# EAGLE design ultra (EAGLE 9.6.2)
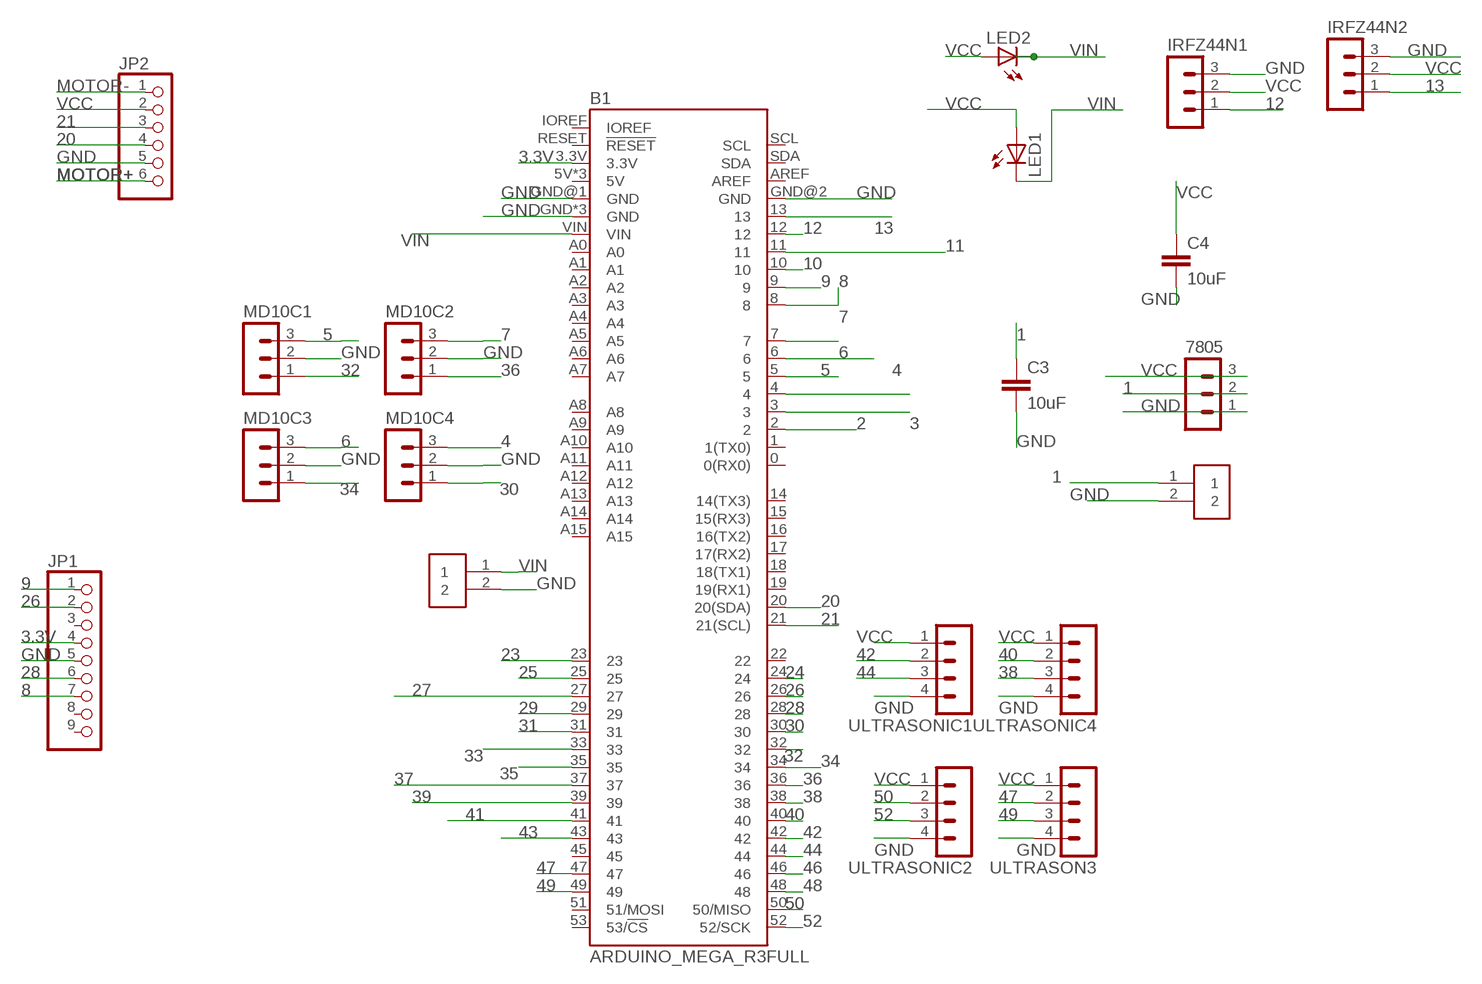
[diagram p0: schematic, sheet 1]

## Parts
7805  MA03-1  [MA03-1]
B1  ARDUINO_MEGA_R3FULL  [ARDUINO_MEGA_NO_SILK]
C3  10uF  10UF-0402T-6.3V-20%  [0402-TIGHT]
C4  10uF  10UF-0402T-6.3V-20%  [0402-TIGHT]
IRFZ44N1  MA03-1  [MA03-1]
IRFZ44N2  MA03-1  [MA03-1]
J1  691311400102  [TERMINALBLOCK_PLUGGABLE-2-7.62MM]
J2  691311400102  [TERMINALBLOCK_PLUGGABLE-2-7.62MM]
JP1  PINHD-1X9  [1X09-BIG]
JP2  PINHD-1X6  [1X06]
LED1  LED  [SMARTLED-TTW]
LED2  LED  [SMARTLED-TTW]
MD10C1  MA03-1  [MA03-1]
MD10C2  MA03-1  [MA03-1]
MD10C3  MA03-1  [MA03-1]
MD10C4  MA03-1  [MA03-1]
ULTRASON3  MA04-1  [MA04-1]
ULTRASONIC1  MA04-1  [MA04-1]
ULTRASONIC2  MA04-1  [MA04-1]
ULTRASONIC4  MA04-1  [MA04-1]

## Nets
1: 7805.2 C3.1 J2.1
2: B1.2
3: B1.3
3.3V: B1.3.3V JP1.4
4: B1.4 MD10C4.3
5: B1.5 MD10C1.3
6: B1.6 MD10C3.3
7: B1.7 MD10C2.3
8: B1.8 JP1.7
9: B1.9 JP1.1
10: B1.10
11: B1.11
12: B1.12 IRFZ44N1.1
13: B1.13 IRFZ44N2.1
20: B1.20(20(SDA)) JP2.4
21: B1.21(21(SCL)) JP2.3
23: B1.23
24: B1.24
25: B1.25
26: B1.26 JP1.2
27: B1.27
28: B1.28 JP1.6
29: B1.29
30: B1.30 MD10C4.1
31: B1.31
32: B1.32 MD10C1.1
33: B1.33
34: B1.34 MD10C3.1
35: B1.35
36: B1.36 MD10C2.1
37: B1.37
38: B1.38 ULTRASONIC4.3
39: B1.39
40: B1.40 ULTRASONIC4.2
41: B1.41
42: B1.42 ULTRASONIC1.2
43: B1.43
44: B1.44 ULTRASONIC1.3
46: B1.46
47: B1.47 ULTRASON3.2
48: B1.48
49: B1.49 ULTRASON3.3
50: B1.50(50/MISO) ULTRASONIC2.2
52: B1.52(52/SCK) ULTRASONIC2.3
GND: 7805.1 B1.GND B1.GND@1(GND) B1.GND@2(GND) B1.GND@3(GND) B1.GND@4(GND) C3.2 C4.2 IRFZ44N1.3 IRFZ44N2.3 J1.2 J2.2 JP1.5 JP2.5 MD10C1.2 MD10C2.2 MD10C3.2 MD10C4.2 ULTRASON3.4 ULTRASONIC1.4 ULTRASONIC2.4 ULTRASONIC4.4
MOTOR+: JP2.6
MOTOR-: JP2.1
VCC: 7805.3 C4.1 IRFZ44N1.2 IRFZ44N2.2 JP2.2 LED1.A@1(A) LED2.A@1(A) ULTRASON3.1 ULTRASONIC1.1 ULTRASONIC2.1 ULTRASONIC4.1
VIN: B1.VIN J1.1 LED1.C@1(C) LED2.C@1(C)
Unconnected: B1.0(0(RX0)) B1.1(1(TX0)) B1.5V B1.5V@1(5V) B1.5V@2(5V) B1.14(14(TX3)) B1.15(15(RX3)) B1.16(16(TX2)) B1.17(17(RX2)) B1.18(18(TX1)) B1.19(19(RX1)) B1.22 B1.45 B1.51(51/MOSI) B1.53(53/!CS) B1.A0 B1.A1 B1.A2 B1.A3 B1.A4 B1.A5 B1.A6 B1.A7 B1.A8 B1.A9 B1.A10 B1.A11 B1.A12 B1.A13 B1.A14 B1.A15 B1.AREF B1.IOREF B1.RESET(!RESET) B1.SCL B1.SDA JP1.3 JP1.8 JP1.9

## Library data of the parts
7805 IRFZ44N1 IRFZ44N2 MD10C1-MD10C4 = con-lstb:MA03-1: PIN HEADER; OC_FARNELL: unknown; OC_NEWARK: unknown
B1 = SparkFun-Boards:ARDUINO_MEGA_R3: Arduino Mega R3 ATmega2560 R3 compatible footprint. SparkFun Products: Arduino Mega 2560 R3 <https://www.sparkfun.com/products/11061>
C3 C4 = SparkFun-Capacitors:10UF: 10.0µF ceramic capacitors A capacitor is a passive two-terminal electrical component used to store electrical energy temporarily in an electric field.; PROD_ID: CAP-14848
J1 J2 = Terminal Blocks FOR USE IN PB:691311400102: 7.62MM CLOSE VERTICAL PCB HEADER WR-TBL Manufacturer's datasheet <https://katalog.we-online.com/em/datasheet/6913114001xx.pdf>; CREATED_BY: PCBLayout.com; DIGIKEY_PART_NO: 732-2823-ND; MANUFACTURER: WURTH ELEKTRONIK; MPN: 691311400102
JP1 = adafruit:PINHD-1X9: Pin header 1x10 0.1" spacing With round pins
JP2 = adafruit:PINHD-1X6: PIN HEADER
LED1 LED2 = adafruit:LED: LED OSRAM: - CHIPLED LG R971, LG N971, LY N971, LG Q971, LY Q971, LO R971, LY R971 LH N974, LH R974 LS Q976, LO Q976, LY Q976 LO Q996 - Hyper CHIPLED LW Q18S LB Q993, LB Q99A, LB R99A - SideLED LS A670, LO A670, LY A670, LG A670, LP A670 LB A673, LV A673, LT A673, LW A673 LH A674 LY A675 LS A676, LA A676, LO A676, LY A676, LW A676 LS A679, LY A679, LG A679 - Hyper Micro SIDELED® LS Y876, LA Y876, LO Y876, LY Y876 LT Y87S - SmartLED LW L88C, LW L88S LB L89C, LB L89S, LG L890 LS L89K, LO L89K, LY L89K LS L896, LA L896, LO L896, LY L896 - TOPLED LS T670, LO T670, LY T670, LG T670, LP T670 LSG T670, LSP T670, LSY T670, LOP T670, LYG T670 LG T671, LOG T671, LSG T671 LB T673, LV T673, LT T673, LW T673 LH T674 LS T676, LA T676, LO T676, LY T676, LB T676, LH T676, LSB T676, LW T676 LB T67C, LV T67C, LT T67C, LS T67K, LO T67K, LY T67K, LW E67C LS E67B, LA E67B, LO E67B, LY E67B, LB E67C, LV E67C, LT E67C LW T67C LS T679, LY T679, LG T679 LS T770, LO T770, LY T770, LG T770, LP T770 LB T773, LV T773, LT T773, LW T773 LH T774 LS E675, LA E675, LY E675, LS T675 LS T776, LA T776, LO T776, LY T776, LB T776 LHGB T686 LT T68C, LB T68C - Hyper Mini TOPLED® LB M676 - Mini TOPLED Santana® LG M470 LS M47K, LO M47K, LY M47K Source: http://www.osram.convergy.de/
ULTRASON3 ULTRASONIC1 ULTRASONIC2 ULTRASONIC4 = con-lstb:MA04-1: PIN HEADER; OC_FARNELL: unknown; OC_NEWARK: unknown

## Board
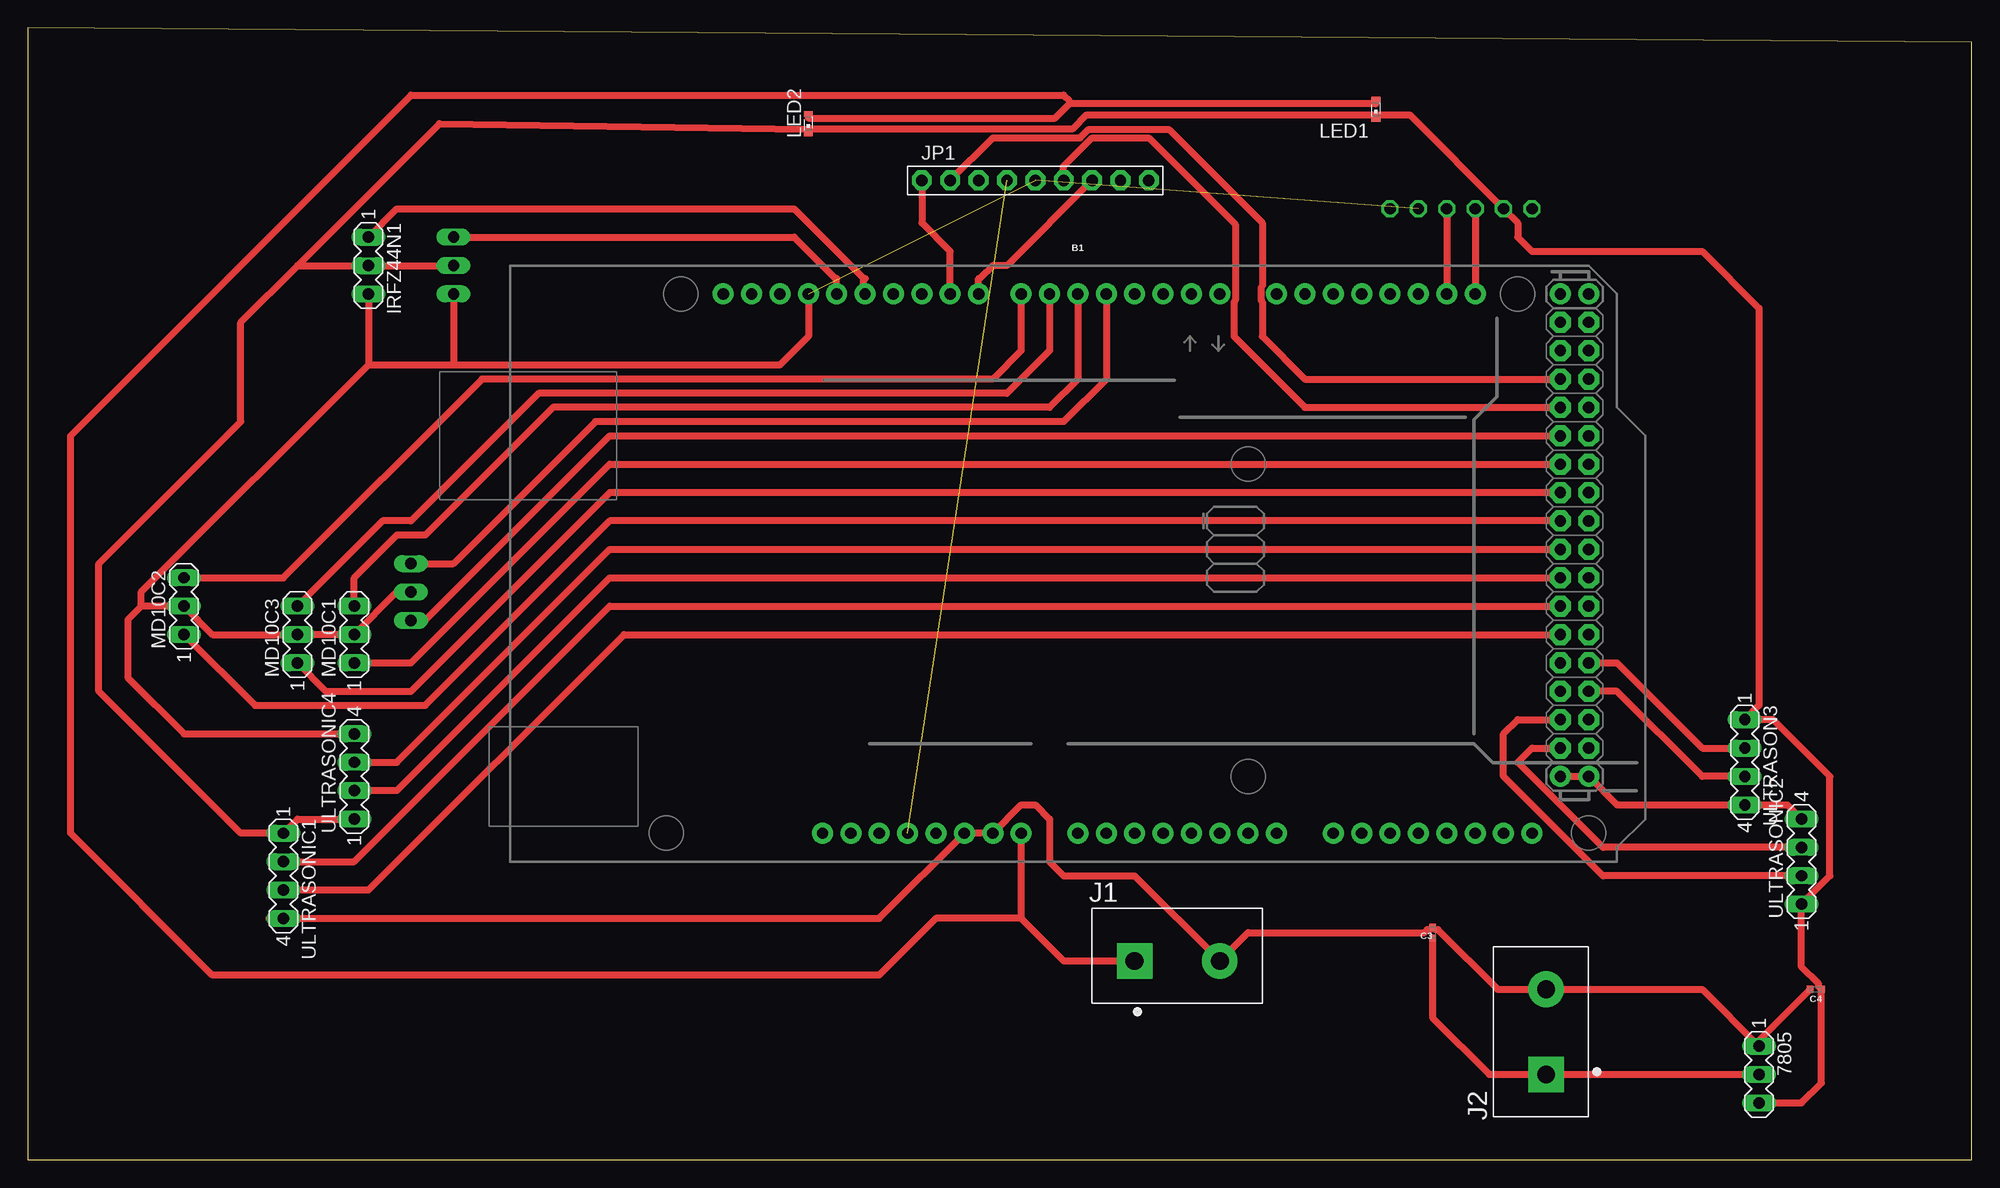
[diagram p1: board, top side]
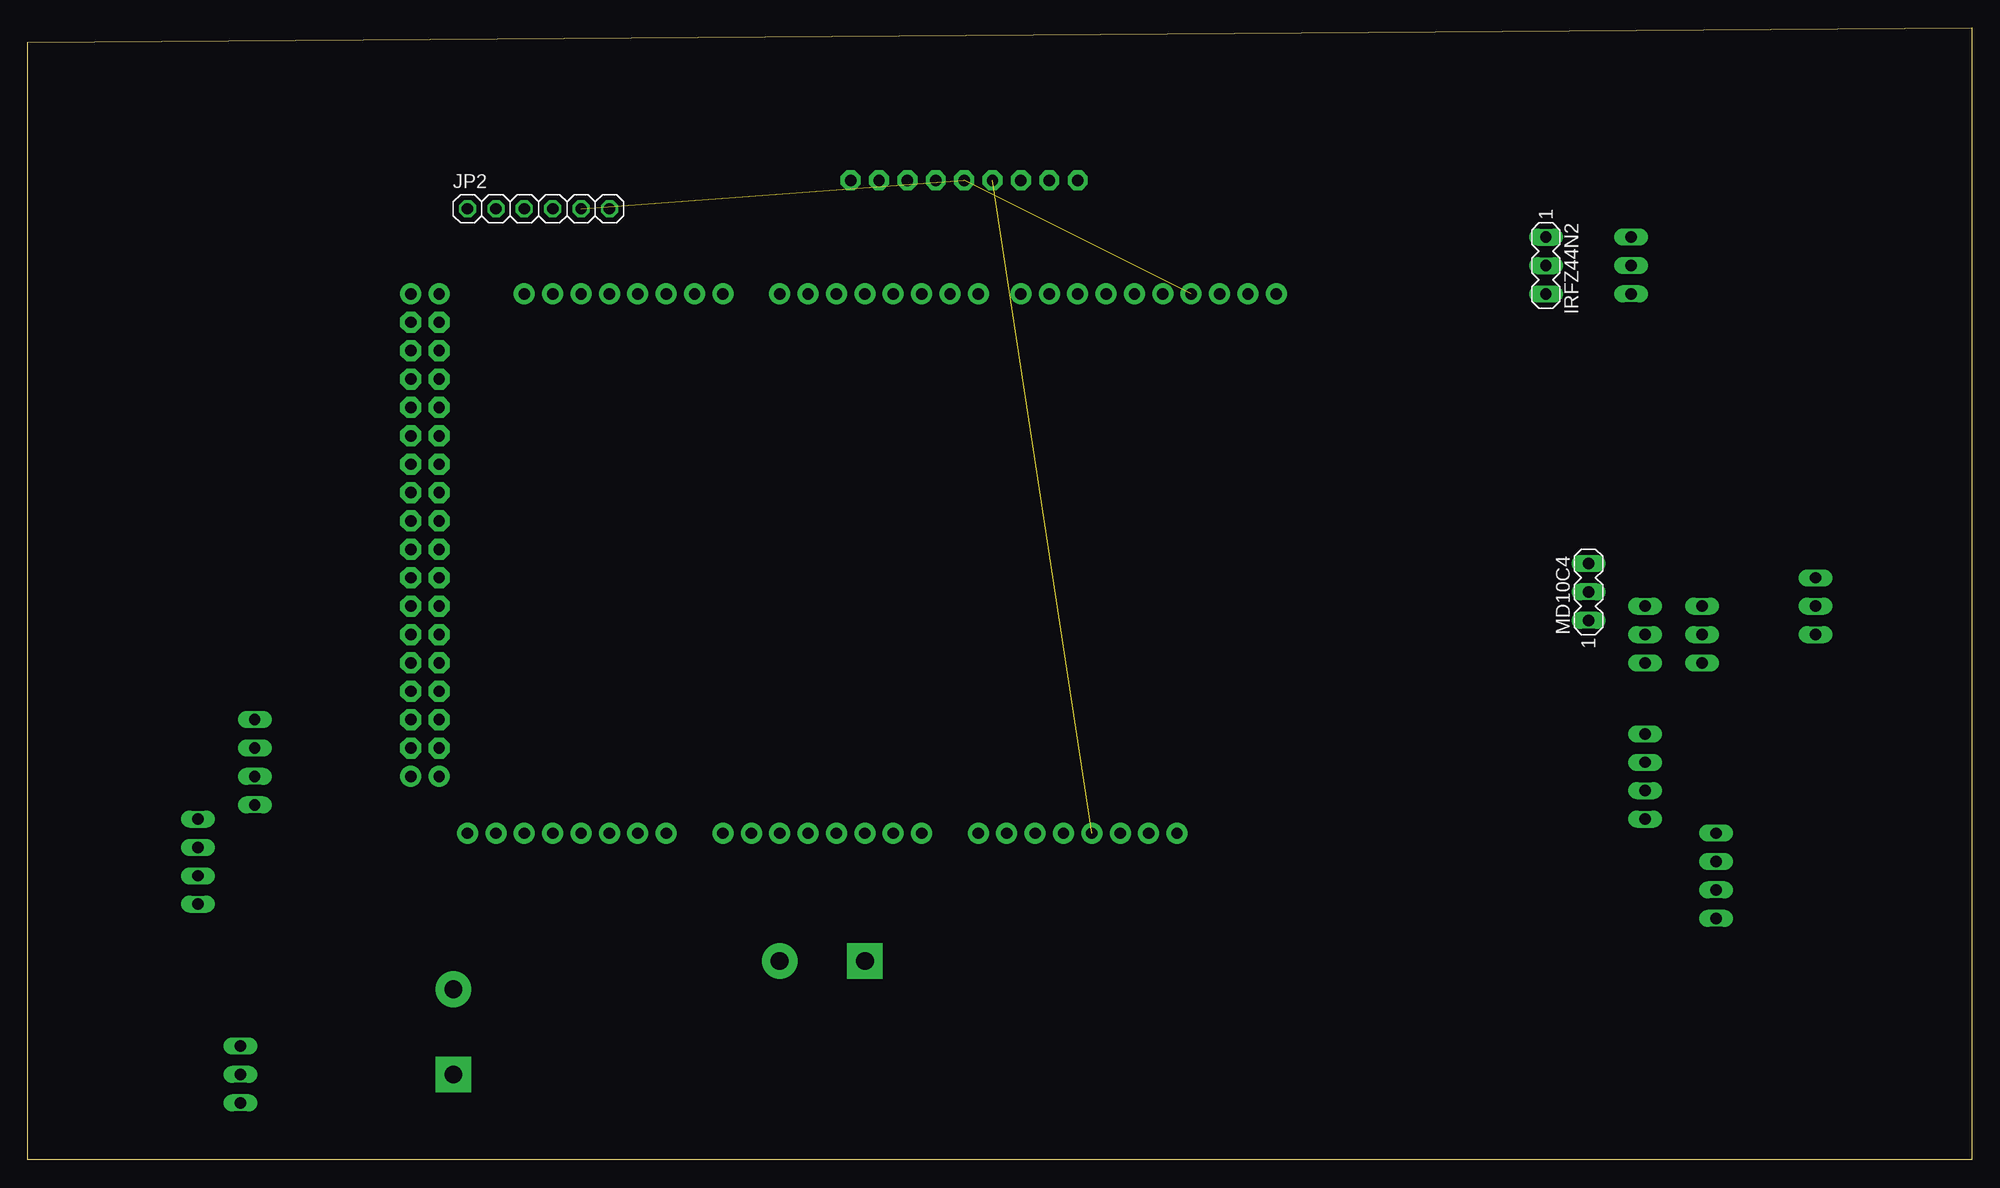
[diagram p2: board, bottom side, seen from below]

Size 173.97 x 101.27 mm. Coordinates in mm from the lower left corner, seen from the top.
Outline: 0,0 173.97,0 173.97,100 0,101.27 0,0
Copper layers (1*16): Top 0.035mm / dielectric 1.5mm / Bottom 0.035mm
Design rules "default": minimum track width 6mil, minimum drill 0.35mm, track to track 6mil, track to pad 6mil, pad to pad 6mil, via to via 6mil, smd to smd 6mil, copper to edge 40mil, drill to drill 6mil, minimum pad ring 10mil, minimum via ring 8mil, stop-mask expansion 4mil, vias tented up to drill 0mil, thermal gap 10mil

### Footprints (pad centres in the part's own frame; a part is rotated, then mirrored left to right if it is on the bottom)
MA03-1 = drill 1.016 long: 1 -2.54,0; 2 0,0; 3 2.54,0
ARDUINO_MEGA_NO_SILK = drill 1.016 pad 1.88: 0 13.97,24.13; 1 11.43,24.13; 2 8.89,24.13; 3 6.35,24.13; 3.3V -13.97,-24.13; 4 3.81,24.13; 5 1.27,24.13; 5V -11.43,-24.13; 5V@1 44.45,24.13; 5V@2 46.99,24.13; 6 -1.27,24.13; 7 -3.81,24.13; 8 -7.62,24.13; 9 -10.16,24.13; 10 -12.7,24.13; 11 -15.24,24.13; 12 -17.78,24.13; 13 -20.32,24.13; 14 19.05,24.13; 15 21.59,24.13; 16 24.13,24.13; 17 26.67,24.13; 18 29.21,24.13; 19 31.75,24.13; 20 34.29,24.13; 21 36.83,24.13; A0 1.27,-24.13; A1 3.81,-24.13; A2 6.35,-24.13; A3 8.89,-24.13; A4 11.43,-24.13; A5 13.97,-24.13; A6 16.51,-24.13; A7 19.05,-24.13; A8 24.13,-24.13; A9 26.67,-24.13; A10 29.21,-24.13; A11 31.75,-24.13; A12 34.29,-24.13; A13 36.83,-24.13; A14 39.37,-24.13; A15 41.91,-24.13; AREF -25.4,24.13; GND -8.89,-24.13; GND@1 -6.35,-24.13; GND@2 44.45,-19.05; GND@3 46.99,-19.05; GND@4 -22.86,24.13; IOREF -19.05,-24.13; NC -21.59,-24.13; RESET -16.51,-24.13; SCL -30.48,24.13; SDA -27.94,24.13; VIN -3.81,-24.13 | drill 1.016 pad 1.88 octagon: 22 44.45,21.59; 23 46.99,21.59; 24 44.45,19.05; 25 46.99,19.05; 26 44.45,16.51; 27 46.99,16.51; 28 44.45,13.97; 29 46.99,13.97; 30 44.45,11.43; 31 46.99,11.43; 32 44.45,8.89; 33 46.99,8.89; 34 44.45,6.35; 35 46.99,6.35; 36 44.45,3.81; 37 46.99,3.81; 38 44.45,1.27; 39 46.99,1.27; 40 44.45,-1.27; 41 46.99,-1.27; 42 44.45,-3.81; 43 46.99,-3.81; 44 44.45,-6.35; 45 46.99,-6.35; 46 44.45,-8.89; 47 46.99,-8.89; 48 44.45,-11.43; 49 46.99,-11.43; 50 44.45,-13.97; 51 46.99,-13.97; 52 44.45,-16.51; 53 46.99,-16.51
0402-TIGHT = smd 0.6 x 0.6: 1 -0.5,0; 2 0.5,0
TERMINALBLOCK_PLUGGABLE-2-7.62MM = drill 1.6 pad 3.2 square: 1 -3.81,0 | drill 1.6 pad 3.2: 2 3.81,0
1X09-BIG = drill 1.016 pad 1.778 octagon: 1 -10.16,0; 2 -7.62,0; 3 -5.08,0; 4 -2.54,0; 5 0,0; 6 2.54,0; 7 5.08,0; 8 7.62,0; 9 10.16,0
1X06 = drill 1.016 octagon: 1 -6.35,0; 2 -3.81,0; 3 -1.27,0; 4 1.27,0; 5 3.81,0; 6 6.35,0
SMARTLED-TTW = smd 0.8 x 0.5: A 0,-0.875; C 0,0.875 | smd 0.35 x 0.35: A@1 0,-0.5; C@1 0,0.5
MA04-1 = drill 1.016 long: 1 -3.81,0; 2 -1.27,0; 3 1.27,0; 4 3.81,0

### Placement (x,y rotation side)
7805  154.94,7.62 270 top
B1  92.71,53.34 0 top
C3  125.73,20.32 90 top
C4  160.02,15.24 180 top
IRFZ44N1  30.48,80.01 270 top
IRFZ44N2  38.1,80.01 270 bottom
J1  102.87,17.78 0 top
J2  135.89,11.43 90 top
JP1  90.17,87.63 0 top
JP2  128.27,85.09 0 bottom
LED1  120.65,93.98 0 top
LED2  69.85,92.71 0 top
MD10C1  29.21,46.99 90 top
MD10C2  13.97,49.53 90 top
MD10C3  24.13,46.99 90 top
MD10C4  34.29,50.8 90 bottom
ULTRASON3  153.67,35.56 270 top
ULTRASONIC1  22.86,25.4 270 top
ULTRASONIC2  158.75,26.67 90 top
ULTRASONIC4  29.21,34.29 90 top

### Tracks (layer width: path | path; a pad name or v marks a point on that pad's centre or on a via)
1
  Top 0.61: C3.1 125.73,12.7 130.81,7.62 J2.1 7805.2
3.3V  (1 unrouted)
4
  Top 0.61: B1.4 96.52,69.85 92.71,66.04 50.8,66.04 38.1,53.34 MD10C4.3
5
  Top 0.61: B1.5 93.98,69.85 91.44,67.31 46.99,67.31 35.56,55.88 33.02,55.88 29.21,52.07 MD10C1.3
6
  Top 0.61: B1.6 91.44,72.39 87.63,68.58 45.72,68.58 34.29,57.15 31.75,57.15 26.11,51.51 MD10C3.3
7
  Top 0.61: B1.7 88.9,72.39 86.36,69.85 40.64,69.85 22.86,52.07 MD10C2.3
8
  Top 0.61: JP1.7 87.63,80.01 86.36,80.01 85.22,78.87 85.09,78.87 B1.8
9
  Top 0.61: JP1.1 80.01,83.82 82.55,81.28 B1.9
12
  Top 0.61: IRFZ44N1.1 33.02,85.09 68.58,85.09 74.8,78.87 | 74.8,78.87 74.93,78.87 | B1.12 74.8,77.6 74.8,78.87
13
  Top 0.61: IRFZ44N2.1 68.58,82.55 72.26,78.87 72.39,78.87 B1.13
20
  Top 0.61: JP2.4 B1.20
21
  Top 0.61: JP2.3 B1.21
26
  Top 0.61: JP1.2 86.36,91.44 94.17,91.44 94.93,92.2 102.11,92.2 110.49,83.82 110.49,78.18 110.36,78.05 110.36,76.89 110.49,76.76 110.49,73.66 114.3,69.85 B1.26
28
  Top 0.61: JP1.6 92.71,88.9 95.25,91.44 100.33,91.44 108.08,83.69 108.08,76.89 107.95,76.76 107.95,73.66 114.3,67.31 B1.28
30
  Top 0.61: MD10C4.1 35.56,48.26 52.07,64.77 B1.30
32
  Top 0.61: MD10C1.1 34.29,44.45 52.07,62.23 B1.32
34
  Top 0.61: MD10C3.1 26.67,41.91 34.29,41.91 52.07,59.69 B1.34
36
  Top 0.61: B1.36 52.07,57.15 35.56,40.64 20.32,40.64 MD10C2.1
38
  Top 0.61: ULTRASONIC4.3 33.02,35.56 52.07,54.61 B1.38
40
  Top 0.61: B1.40 52.07,52.07 33.02,33.02 ULTRASONIC4.2
42
  Top 0.61: ULTRASONIC1.2 29.21,26.67 52.07,49.53 B1.42
44
  Top 0.61: ULTRASONIC1.3 30.48,24.13 53.34,46.99 B1.44
47
  Top 0.61: B1.47 142.24,44.45 149.86,36.83 ULTRASON3.2
49
  Top 0.61: ULTRASON3.3 149.86,34.29 142.24,41.91 B1.49
50
  Top 0.61: ULTRASONIC2.2 140.97,25.4 132.08,34.29 132.08,38.1 133.35,39.37 B1.50
52
  Top 0.61: ULTRASONIC2.3 140.97,27.94 133.35,35.56 134.62,36.83 B1.52
GND  (2 unrouted)
  Top 0.61: 21.59,21.59 ULTRASONIC1.4 76.2,21.59 B1.GND B1.GND@1 88.9,31.75 90.17,31.75 91.44,30.48 91.44,26.67 92.71,25.4 99.06,25.4 J1.2 109.22,20.32 124.98,20.32 125.24,20.58 125.49,20.58 C3.2 125.97,20.58 126.22,20.58 131.56,15.24 J2.2 149.86,15.24 7805.1 154.94,10.66 C4.2 | MD10C4.2 33.02,50.8 MD10C1.2 MD10C3.2 16.51,46.99 MD10C2.2 10.16,49.53 | 10.16,49.53 8.94,48.31 8.94,43.13 13.97,38.1 ULTRASONIC4.4 | 10.16,49.53 10.16,50.8 30.48,71.12 | 30.48,71.12 38.1,71.12 | 38.1,71.12 67.31,71.12 69.85,73.66 B1.GND@4 | IRFZ44N1.3 30.48,71.12 | IRFZ44N2.3 38.1,71.12 | B1.GND@2 B1.GND@3 142.24,31.75 ULTRASON3.4 157.48,31.75 ULTRASONIC2.4
VCC
  Top 0.61: ULTRASONIC4.1 24.13,30.48 ULTRASONIC1.1 19.05,29.21 6.35,41.91 6.35,53.34 19.05,66.04 19.05,74.93 24.13,80.01 | 24.13,80.01 IRFZ44N1.2 IRFZ44N2.2 | 24.13,80.01 36.83,92.71 LED2.A@1 93.48,92.21 94.75,93.48 LED1.A@1 123.69,93.48 JP2.2 133.35,83.82 133.35,82.55 134.62,81.28 149.86,81.28 154.94,76.2 154.94,40.64 ULTRASON3.1 156.21,39.37 161.29,34.29 161.29,25.4 ULTRASONIC2.1 158.75,17.26 160.28,15.72 160.28,15.48 C4.1 160.52,6.85 158.75,5.08 7805.3
VIN
  Top 0.61: B1.VIN 88.9,21.59 | 88.9,21.59 92.71,17.78 J1.1 | 88.9,21.59 81.28,21.59 76.2,16.51 16.51,16.51 3.81,29.21 3.81,64.77 34.29,95.25 92.71,95.25 93.21,94.75 93.21,94.48 | LED2.C@1 91.94,93.21 93.21,94.48 | LED1.C@1 93.21,94.48